# Altium schematic sheet 12.RK3588 DDR Controler.SchDoc
size 420 x 297 mm; Revision: V2.1; Schematic Page Number: 11; Page Number: 12; Check: <Checker>; Schematic Name: RK_NVR_DEMO1_RK3588_LP4/4x_V21; Page Count: 43; Page name: 12.RK3588 DDR Controler; Designer: Zhangdz; Schematic Page Count: 99; Revcode: V2.1; DsnPath: E:\Work\SBER\RK3588_SOM\temp\RK_NVR_DEMO1_RK3588_LP4XD200P232SD8_V21_20211228.DSN; SchematicName: RK_NVR_DEMO1_RK3588_LP4/4x_V21; PageName: 12.RK3588 DDR Controler; PageSize: A3; TopSchematic: True
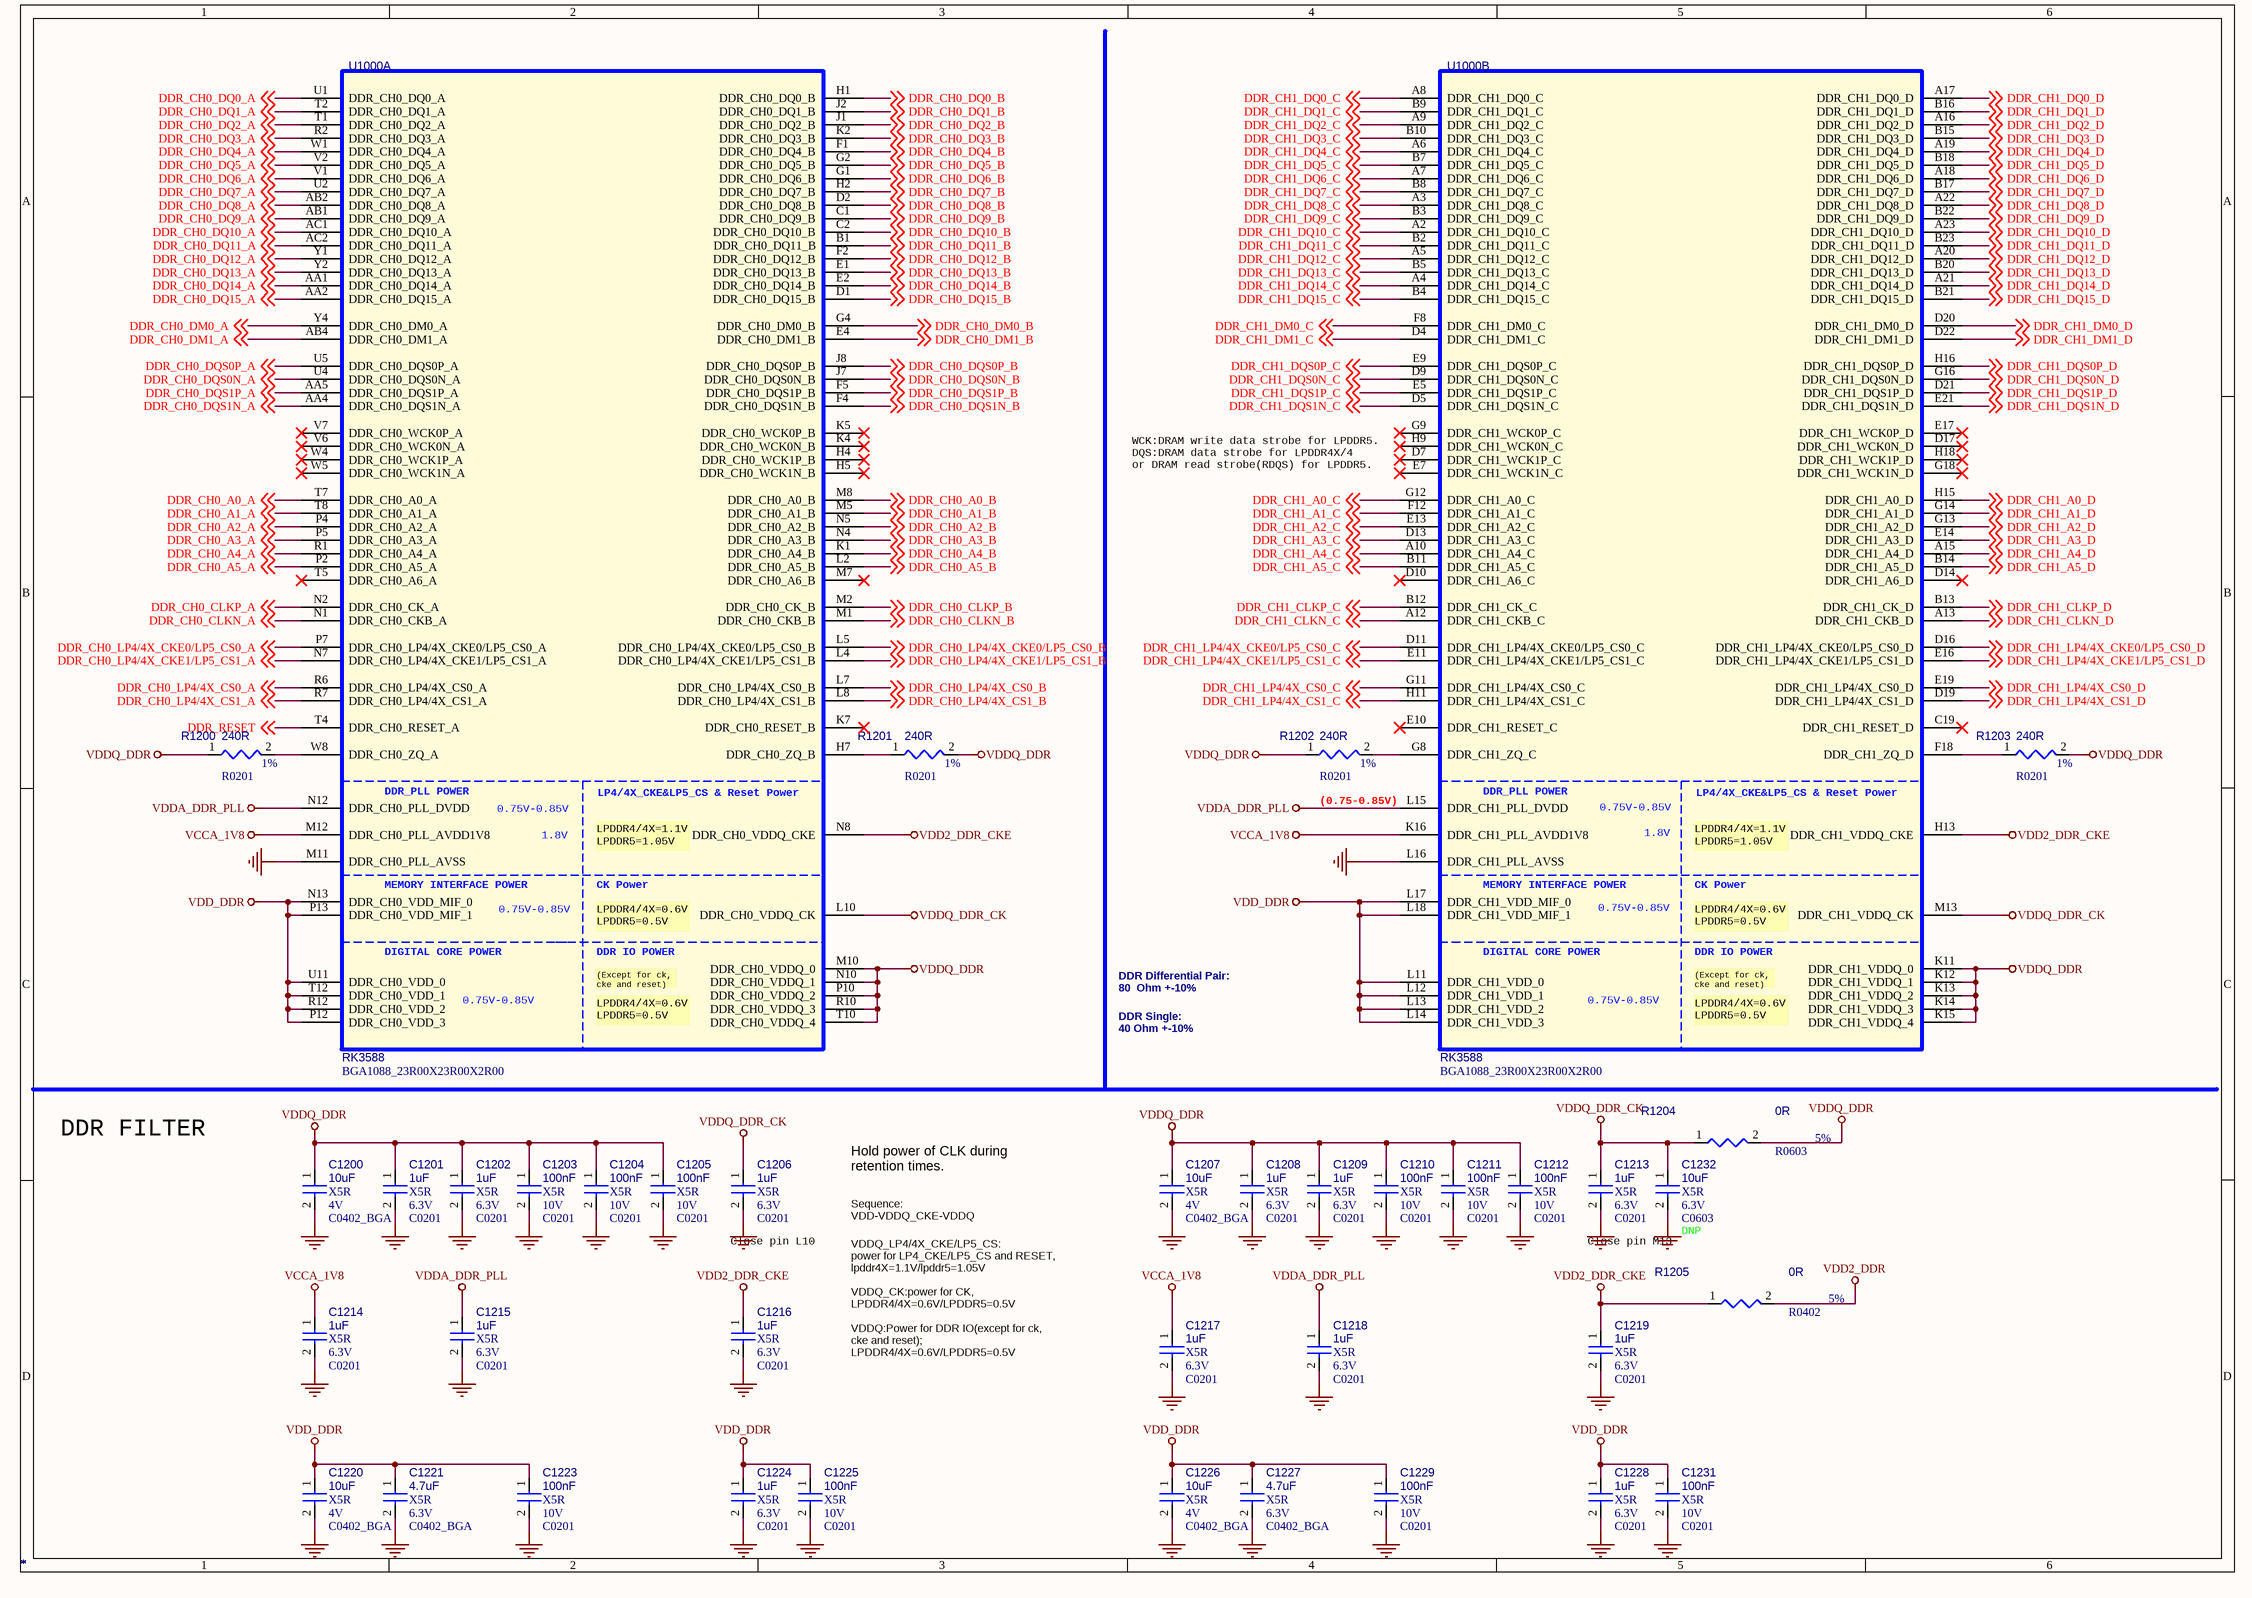
[diagram p0: 12.RK3588 DDR Controler.SchDoc]

## Parts
C1200  *  Voltage: 4V  Dielectric: X5R  [C0402_BGA]
C1201  *  Voltage: 6.3V  Dielectric: X5R  [C0201]
C1202  *  Voltage: 6.3V  Dielectric: X5R  [C0201]
C1203  *  Voltage: 10V  Dielectric: X5R  [C0201]
C1204  *  Voltage: 10V  Dielectric: X5R  [C0201]
C1205  *  Voltage: 10V  Dielectric: X5R  [C0201]
C1206  *  Voltage: 6.3V  Dielectric: X5R  [C0201]
C1207  *  Voltage: 4V  Dielectric: X5R  [C0402_BGA]
C1208  *  Voltage: 6.3V  Dielectric: X5R  [C0201]
C1209  *  Voltage: 6.3V  Dielectric: X5R  [C0201]
C1210  *  Voltage: 10V  Dielectric: X5R  [C0201]
C1211  *  Voltage: 10V  Dielectric: X5R  [C0201]
C1212  *  Voltage: 10V  Dielectric: X5R  [C0201]
C1213  *  Voltage: 6.3V  Dielectric: X5R  [C0201]
C1214  *  Voltage: 6.3V  Dielectric: X5R  [C0201]
C1215  *  Voltage: 6.3V  Dielectric: X5R  [C0201]
C1216  *  Voltage: 6.3V  Dielectric: X5R  [C0201]
C1217  *  Voltage: 6.3V  Dielectric: X5R  [C0201]
C1218  *  Voltage: 6.3V  Dielectric: X5R  [C0201]
C1219  *  Voltage: 6.3V  Dielectric: X5R  [C0201]
C1220  *  Voltage: 4V  Dielectric: X5R  [C0402_BGA]
C1221  *  Voltage: 6.3V  Dielectric: X5R  [C0402_BGA]
C1223  *  Voltage: 10V  Dielectric: X5R  [C0201]
C1224  *  Voltage: 6.3V  Dielectric: X5R  [C0201]
C1225  *  Voltage: 10V  Dielectric: X5R  [C0201]
C1226  *  Voltage: 4V  Dielectric: X5R  [C0402_BGA]
C1227  *  Voltage: 6.3V  Dielectric: X5R  [C0402_BGA]
C1228  *  Voltage: 6.3V  Dielectric: X5R  [C0201]
C1229  *  Voltage: 10V  Dielectric: X5R  [C0201]
C1231  *  Voltage: 10V  Dielectric: X5R  [C0201]
C1232  *  Voltage: 6.3V  Dielectric: X5R  Option: DNP  [C0603]
R1200  *  PCB Footprint: R0201  Tolerance: 1%  [R0402]
R1201  *  PCB Footprint: R0201  Tolerance: 1%  [R0402]
R1202  *  PCB Footprint: R0201  Tolerance: 1%  [R0402]
R1203  *  PCB Footprint: R0201  Tolerance: 1%  [R0402]
R1204  *  PCB Footprint: R0603  Tolerance: 5%  [R0402]
R1205  *  Tolerance: 5%  [R0402]
U1000  *  [BGA1088_23R00X23R00X2R00]  (parts A,B of 26)

## Nets
(0.75-0.85V): C1215.1 C1218.1 U1000.L15(DDR_CH1_PLL_DVDD) U1000.N12(DDR_CH0_PLL_DVDD)  [also labelled VDDA_DDR_PLL]
GND: C1200.2 C1201.2 C1202.2 C1203.2 C1204.2 C1205.2 C1206.2 C1207.2 C1208.2 C1209.2 C1210.2 C1211.2 C1212.2 C1213.2 C1214.2 C1215.2 C1216.2 C1217.2 C1218.2 C1219.2 C1220.2 C1221.2 C1223.2 C1224.2 C1225.2 C1226.2 C1227.2 C1228.2 C1229.2 C1231.2 C1232.2 U1000.L16(DDR_CH1_PLL_AVSS) U1000.M11(DDR_CH0_PLL_AVSS)
VCCA_1V8: C1214.1 C1217.1 U1000.K16(DDR_CH1_PLL_AVDD1V8) U1000.M12(DDR_CH0_PLL_AVDD1V8)
VDD2_DDR: R1205.2
VDD2_DDR_CKE: C1216.1 C1219.1 R1205.1 U1000.H13(DDR_CH1_VDDQ_CKE) U1000.N8(DDR_CH0_VDDQ_CKE)
VDD_DDR: C1220.1 C1221.1 C1223.1 C1224.1 C1225.1 C1226.1 C1227.1 C1228.1 C1229.1 C1231.1 U1000.L11(DDR_CH1_VDD_0) U1000.L12(DDR_CH1_VDD_1) U1000.L13(DDR_CH1_VDD_2) U1000.L14(DDR_CH1_VDD_3) U1000.L17(DDR_CH1_VDD_MIF_0) U1000.L18(DDR_CH1_VDD_MIF_1) U1000.N13(DDR_CH0_VDD_MIF_0) U1000.P12(DDR_CH0_VDD_3) U1000.P13(DDR_CH0_VDD_MIF_1) U1000.R12(DDR_CH0_VDD_2) U1000.T12(DDR_CH0_VDD_1) U1000.U11(DDR_CH0_VDD_0)
VDDQ_DDR: C1200.1 C1201.1 C1202.1 C1203.1 C1204.1 C1205.1 C1207.1 C1208.1 C1209.1 C1210.1 C1211.1 C1212.1 R1200.1 R1201.2 R1202.1 R1203.2 R1204.2 U1000.K11(DDR_CH1_VDDQ_0) U1000.K12(DDR_CH1_VDDQ_1) U1000.K13(DDR_CH1_VDDQ_2) U1000.K14(DDR_CH1_VDDQ_3) U1000.K15(DDR_CH1_VDDQ_4) U1000.M10(DDR_CH0_VDDQ_0) U1000.N10(DDR_CH0_VDDQ_1) U1000.P10(DDR_CH0_VDDQ_2) U1000.R10(DDR_CH0_VDDQ_3) U1000.T10(DDR_CH0_VDDQ_4)
VDDQ_DDR_CK: C1206.1 C1213.1 C1232.1 R1204.1 U1000.L10(DDR_CH0_VDDQ_CK) U1000.M13(DDR_CH1_VDDQ_CK)
DDR_CH0_A0_A: U1000.T7(DDR_CH0_A0_A) ; off-sheet DDR_CH0_A0_A
DDR_CH0_A0_B: U1000.M8(DDR_CH0_A0_B) ; off-sheet DDR_CH0_A0_B
DDR_CH0_A1_A: U1000.T8(DDR_CH0_A1_A) ; off-sheet DDR_CH0_A1_A
DDR_CH0_A1_B: U1000.M5(DDR_CH0_A1_B) ; off-sheet DDR_CH0_A1_B
DDR_CH0_A2_A: U1000.P4(DDR_CH0_A2_A) ; off-sheet DDR_CH0_A2_A
DDR_CH0_A2_B: U1000.N5(DDR_CH0_A2_B) ; off-sheet DDR_CH0_A2_B
DDR_CH0_A3_A: U1000.P5(DDR_CH0_A3_A) ; off-sheet DDR_CH0_A3_A
DDR_CH0_A3_B: U1000.N4(DDR_CH0_A3_B) ; off-sheet DDR_CH0_A3_B
DDR_CH0_A4_A: U1000.R1(DDR_CH0_A4_A) ; off-sheet DDR_CH0_A4_A
DDR_CH0_A4_B: U1000.K1(DDR_CH0_A4_B) ; off-sheet DDR_CH0_A4_B
DDR_CH0_A5_A: U1000.P2(DDR_CH0_A5_A) ; off-sheet DDR_CH0_A5_A
DDR_CH0_A5_B: U1000.L2(DDR_CH0_A5_B) ; off-sheet DDR_CH0_A5_B
DDR_CH0_CLKN_A: U1000.N1(DDR_CH0_CKB_A) ; off-sheet DDR_CH0_CLKN_A
DDR_CH0_CLKN_B: U1000.M1(DDR_CH0_CKB_B) ; off-sheet DDR_CH0_CLKN_B
DDR_CH0_CLKP_A: U1000.N2(DDR_CH0_CK_A) ; off-sheet DDR_CH0_CLKP_A
DDR_CH0_CLKP_B: U1000.M2(DDR_CH0_CK_B) ; off-sheet DDR_CH0_CLKP_B
DDR_CH0_DM0_A: U1000.Y4(DDR_CH0_DM0_A) ; off-sheet DDR_CH0_DM0_A
DDR_CH0_DM0_B: U1000.G4(DDR_CH0_DM0_B) ; off-sheet DDR_CH0_DM0_B
DDR_CH0_DM1_A: U1000.AB4(DDR_CH0_DM1_A) ; off-sheet DDR_CH0_DM1_A
DDR_CH0_DM1_B: U1000.E4(DDR_CH0_DM1_B) ; off-sheet DDR_CH0_DM1_B
DDR_CH0_DQ0_A: U1000.U1(DDR_CH0_DQ0_A) ; off-sheet DDR_CH0_DQ0_A
DDR_CH0_DQ0_B: U1000.H1(DDR_CH0_DQ0_B) ; off-sheet DDR_CH0_DQ0_B
DDR_CH0_DQ1_A: U1000.T2(DDR_CH0_DQ1_A) ; off-sheet DDR_CH0_DQ1_A
DDR_CH0_DQ1_B: U1000.J2(DDR_CH0_DQ1_B) ; off-sheet DDR_CH0_DQ1_B
DDR_CH0_DQ2_A: U1000.T1(DDR_CH0_DQ2_A) ; off-sheet DDR_CH0_DQ2_A
DDR_CH0_DQ2_B: U1000.J1(DDR_CH0_DQ2_B) ; off-sheet DDR_CH0_DQ2_B
DDR_CH0_DQ3_A: U1000.R2(DDR_CH0_DQ3_A) ; off-sheet DDR_CH0_DQ3_A
DDR_CH0_DQ3_B: U1000.K2(DDR_CH0_DQ3_B) ; off-sheet DDR_CH0_DQ3_B
DDR_CH0_DQ4_A: U1000.W1(DDR_CH0_DQ4_A) ; off-sheet DDR_CH0_DQ4_A
DDR_CH0_DQ4_B: U1000.F1(DDR_CH0_DQ4_B) ; off-sheet DDR_CH0_DQ4_B
DDR_CH0_DQ5_A: U1000.V2(DDR_CH0_DQ5_A) ; off-sheet DDR_CH0_DQ5_A
DDR_CH0_DQ5_B: U1000.G2(DDR_CH0_DQ5_B) ; off-sheet DDR_CH0_DQ5_B
DDR_CH0_DQ6_A: U1000.V1(DDR_CH0_DQ6_A) ; off-sheet DDR_CH0_DQ6_A
DDR_CH0_DQ6_B: U1000.G1(DDR_CH0_DQ6_B) ; off-sheet DDR_CH0_DQ6_B
DDR_CH0_DQ7_A: U1000.U2(DDR_CH0_DQ7_A) ; off-sheet DDR_CH0_DQ7_A
DDR_CH0_DQ7_B: U1000.H2(DDR_CH0_DQ7_B) ; off-sheet DDR_CH0_DQ7_B
DDR_CH0_DQ8_A: U1000.AB2(DDR_CH0_DQ8_A) ; off-sheet DDR_CH0_DQ8_A
DDR_CH0_DQ8_B: U1000.D2(DDR_CH0_DQ8_B) ; off-sheet DDR_CH0_DQ8_B
DDR_CH0_DQ9_A: U1000.AB1(DDR_CH0_DQ9_A) ; off-sheet DDR_CH0_DQ9_A
DDR_CH0_DQ9_B: U1000.C1(DDR_CH0_DQ9_B) ; off-sheet DDR_CH0_DQ9_B
DDR_CH0_DQ10_A: U1000.AC1(DDR_CH0_DQ10_A) ; off-sheet DDR_CH0_DQ10_A
DDR_CH0_DQ10_B: U1000.C2(DDR_CH0_DQ10_B) ; off-sheet DDR_CH0_DQ10_B
DDR_CH0_DQ11_A: U1000.AC2(DDR_CH0_DQ11_A) ; off-sheet DDR_CH0_DQ11_A
DDR_CH0_DQ11_B: U1000.B1(DDR_CH0_DQ11_B) ; off-sheet DDR_CH0_DQ11_B
DDR_CH0_DQ12_A: U1000.Y1(DDR_CH0_DQ12_A) ; off-sheet DDR_CH0_DQ12_A
DDR_CH0_DQ12_B: U1000.F2(DDR_CH0_DQ12_B) ; off-sheet DDR_CH0_DQ12_B
DDR_CH0_DQ13_A: U1000.Y2(DDR_CH0_DQ13_A) ; off-sheet DDR_CH0_DQ13_A
DDR_CH0_DQ13_B: U1000.E1(DDR_CH0_DQ13_B) ; off-sheet DDR_CH0_DQ13_B
DDR_CH0_DQ14_A: U1000.AA1(DDR_CH0_DQ14_A) ; off-sheet DDR_CH0_DQ14_A
DDR_CH0_DQ14_B: U1000.E2(DDR_CH0_DQ14_B) ; off-sheet DDR_CH0_DQ14_B
DDR_CH0_DQ15_A: U1000.AA2(DDR_CH0_DQ15_A) ; off-sheet DDR_CH0_DQ15_A
DDR_CH0_DQ15_B: U1000.D1(DDR_CH0_DQ15_B) ; off-sheet DDR_CH0_DQ15_B
DDR_CH0_DQS0N_A: U1000.U4(DDR_CH0_DQS0N_A) ; off-sheet DDR_CH0_DQS0N_A
DDR_CH0_DQS0N_B: U1000.J7(DDR_CH0_DQS0N_B) ; off-sheet DDR_CH0_DQS0N_B
DDR_CH0_DQS0P_A: U1000.U5(DDR_CH0_DQS0P_A) ; off-sheet DDR_CH0_DQS0P_A
DDR_CH0_DQS0P_B: U1000.J8(DDR_CH0_DQS0P_B) ; off-sheet DDR_CH0_DQS0P_B
DDR_CH0_DQS1N_A: U1000.AA4(DDR_CH0_DQS1N_A) ; off-sheet DDR_CH0_DQS1N_A
DDR_CH0_DQS1N_B: U1000.F4(DDR_CH0_DQS1N_B) ; off-sheet DDR_CH0_DQS1N_B
DDR_CH0_DQS1P_A: U1000.AA5(DDR_CH0_DQS1P_A) ; off-sheet DDR_CH0_DQS1P_A
DDR_CH0_DQS1P_B: U1000.F5(DDR_CH0_DQS1P_B) ; off-sheet DDR_CH0_DQS1P_B
DDR_CH0_LP4/4X_CKE0/LP5_CS0_A: U1000.P7(DDR_CH0_LP4/4X_CKE0/LP5_CS0_A) ; off-sheet DDR_CH0_LP4/4X_CKE0/LP5_CS0_A
DDR_CH0_LP4/4X_CKE0/LP5_CS0_B: U1000.L5(DDR_CH0_LP4/4X_CKE0/LP5_CS0_B) ; off-sheet DDR_CH0_LP4/4X_CKE0/LP5_CS0_B
DDR_CH0_LP4/4X_CKE1/LP5_CS1_A: U1000.N7(DDR_CH0_LP4/4X_CKE1/LP5_CS1_A) ; off-sheet DDR_CH0_LP4/4X_CKE1/LP5_CS1_A
DDR_CH0_LP4/4X_CKE1/LP5_CS1_B: U1000.L4(DDR_CH0_LP4/4X_CKE1/LP5_CS1_B) ; off-sheet DDR_CH0_LP4/4X_CKE1/LP5_CS1_B
DDR_CH0_LP4/4X_CS0_A: U1000.R6(DDR_CH0_LP4/4X_CS0_A) ; off-sheet DDR_CH0_LP4/4X_CS0_A
DDR_CH0_LP4/4X_CS0_B: U1000.L7(DDR_CH0_LP4/4X_CS0_B) ; off-sheet DDR_CH0_LP4/4X_CS0_B
DDR_CH0_LP4/4X_CS1_A: U1000.R7(DDR_CH0_LP4/4X_CS1_A) ; off-sheet DDR_CH0_LP4/4X_CS1_A
DDR_CH0_LP4/4X_CS1_B: U1000.L8(DDR_CH0_LP4/4X_CS1_B) ; off-sheet DDR_CH0_LP4/4X_CS1_B
DDR_CH1_A0_C: U1000.G12(DDR_CH1_A0_C) ; off-sheet DDR_CH1_A0_C
DDR_CH1_A0_D: U1000.H15(DDR_CH1_A0_D) ; off-sheet DDR_CH1_A0_D
DDR_CH1_A1_C: U1000.F12(DDR_CH1_A1_C) ; off-sheet DDR_CH1_A1_C
DDR_CH1_A1_D: U1000.G14(DDR_CH1_A1_D) ; off-sheet DDR_CH1_A1_D
DDR_CH1_A2_C: U1000.E13(DDR_CH1_A2_C) ; off-sheet DDR_CH1_A2_C
DDR_CH1_A2_D: U1000.G13(DDR_CH1_A2_D) ; off-sheet DDR_CH1_A2_D
DDR_CH1_A3_C: U1000.D13(DDR_CH1_A3_C) ; off-sheet DDR_CH1_A3_C
DDR_CH1_A3_D: U1000.E14(DDR_CH1_A3_D) ; off-sheet DDR_CH1_A3_D
DDR_CH1_A4_C: U1000.A10(DDR_CH1_A4_C) ; off-sheet DDR_CH1_A4_C
DDR_CH1_A4_D: U1000.A15(DDR_CH1_A4_D) ; off-sheet DDR_CH1_A4_D
DDR_CH1_A5_C: U1000.B11(DDR_CH1_A5_C) ; off-sheet DDR_CH1_A5_C
DDR_CH1_A5_D: U1000.B14(DDR_CH1_A5_D) ; off-sheet DDR_CH1_A5_D
DDR_CH1_CLKN_C: U1000.A12(DDR_CH1_CKB_C) ; off-sheet DDR_CH1_CLKN_C
DDR_CH1_CLKN_D: U1000.A13(DDR_CH1_CKB_D) ; off-sheet DDR_CH1_CLKN_D
DDR_CH1_CLKP_C: U1000.B12(DDR_CH1_CK_C) ; off-sheet DDR_CH1_CLKP_C
DDR_CH1_CLKP_D: U1000.B13(DDR_CH1_CK_D) ; off-sheet DDR_CH1_CLKP_D
DDR_CH1_DM0_C: U1000.F8(DDR_CH1_DM0_C) ; off-sheet DDR_CH1_DM0_C
DDR_CH1_DM0_D: U1000.D20(DDR_CH1_DM0_D) ; off-sheet DDR_CH1_DM0_D
DDR_CH1_DM1_C: U1000.D4(DDR_CH1_DM1_C) ; off-sheet DDR_CH1_DM1_C
DDR_CH1_DM1_D: U1000.D22(DDR_CH1_DM1_D) ; off-sheet DDR_CH1_DM1_D
DDR_CH1_DQ0_C: U1000.A8(DDR_CH1_DQ0_C) ; off-sheet DDR_CH1_DQ0_C
DDR_CH1_DQ0_D: U1000.A17(DDR_CH1_DQ0_D) ; off-sheet DDR_CH1_DQ0_D
DDR_CH1_DQ1_C: U1000.B9(DDR_CH1_DQ1_C) ; off-sheet DDR_CH1_DQ1_C
DDR_CH1_DQ1_D: U1000.B16(DDR_CH1_DQ1_D) ; off-sheet DDR_CH1_DQ1_D
DDR_CH1_DQ2_C: U1000.A9(DDR_CH1_DQ2_C) ; off-sheet DDR_CH1_DQ2_C
DDR_CH1_DQ2_D: U1000.A16(DDR_CH1_DQ2_D) ; off-sheet DDR_CH1_DQ2_D
DDR_CH1_DQ3_C: U1000.B10(DDR_CH1_DQ3_C) ; off-sheet DDR_CH1_DQ3_C
DDR_CH1_DQ3_D: U1000.B15(DDR_CH1_DQ3_D) ; off-sheet DDR_CH1_DQ3_D
DDR_CH1_DQ4_C: U1000.A6(DDR_CH1_DQ4_C) ; off-sheet DDR_CH1_DQ4_C
DDR_CH1_DQ4_D: U1000.A19(DDR_CH1_DQ4_D) ; off-sheet DDR_CH1_DQ4_D
DDR_CH1_DQ5_C: U1000.B7(DDR_CH1_DQ5_C) ; off-sheet DDR_CH1_DQ5_C
DDR_CH1_DQ5_D: U1000.B18(DDR_CH1_DQ5_D) ; off-sheet DDR_CH1_DQ5_D
DDR_CH1_DQ6_C: U1000.A7(DDR_CH1_DQ6_C) ; off-sheet DDR_CH1_DQ6_C
DDR_CH1_DQ6_D: U1000.A18(DDR_CH1_DQ6_D) ; off-sheet DDR_CH1_DQ6_D
DDR_CH1_DQ7_C: U1000.B8(DDR_CH1_DQ7_C) ; off-sheet DDR_CH1_DQ7_C
DDR_CH1_DQ7_D: U1000.B17(DDR_CH1_DQ7_D) ; off-sheet DDR_CH1_DQ7_D
DDR_CH1_DQ8_C: U1000.A3(DDR_CH1_DQ8_C) ; off-sheet DDR_CH1_DQ8_C
DDR_CH1_DQ8_D: U1000.A22(DDR_CH1_DQ8_D) ; off-sheet DDR_CH1_DQ8_D
DDR_CH1_DQ9_C: U1000.B3(DDR_CH1_DQ9_C) ; off-sheet DDR_CH1_DQ9_C
DDR_CH1_DQ9_D: U1000.B22(DDR_CH1_DQ9_D) ; off-sheet DDR_CH1_DQ9_D
DDR_CH1_DQ10_C: U1000.A2(DDR_CH1_DQ10_C) ; off-sheet DDR_CH1_DQ10_C
DDR_CH1_DQ10_D: U1000.A23(DDR_CH1_DQ10_D) ; off-sheet DDR_CH1_DQ10_D
DDR_CH1_DQ11_C: U1000.B2(DDR_CH1_DQ11_C) ; off-sheet DDR_CH1_DQ11_C
DDR_CH1_DQ11_D: U1000.B23(DDR_CH1_DQ11_D) ; off-sheet DDR_CH1_DQ11_D
DDR_CH1_DQ12_C: U1000.A5(DDR_CH1_DQ12_C) ; off-sheet DDR_CH1_DQ12_C
DDR_CH1_DQ12_D: U1000.A20(DDR_CH1_DQ12_D) ; off-sheet DDR_CH1_DQ12_D
DDR_CH1_DQ13_C: U1000.B5(DDR_CH1_DQ13_C) ; off-sheet DDR_CH1_DQ13_C
DDR_CH1_DQ13_D: U1000.B20(DDR_CH1_DQ13_D) ; off-sheet DDR_CH1_DQ13_D
DDR_CH1_DQ14_C: U1000.A4(DDR_CH1_DQ14_C) ; off-sheet DDR_CH1_DQ14_C
DDR_CH1_DQ14_D: U1000.A21(DDR_CH1_DQ14_D) ; off-sheet DDR_CH1_DQ14_D
DDR_CH1_DQ15_C: U1000.B4(DDR_CH1_DQ15_C) ; off-sheet DDR_CH1_DQ15_C
DDR_CH1_DQ15_D: U1000.B21(DDR_CH1_DQ15_D) ; off-sheet DDR_CH1_DQ15_D
DDR_CH1_DQS0N_C: U1000.D9(DDR_CH1_DQS0N_C) ; off-sheet DDR_CH1_DQS0N_C
DDR_CH1_DQS0N_D: U1000.G16(DDR_CH1_DQS0N_D) ; off-sheet DDR_CH1_DQS0N_D
DDR_CH1_DQS0P_C: U1000.E9(DDR_CH1_DQS0P_C) ; off-sheet DDR_CH1_DQS0P_C
DDR_CH1_DQS0P_D: U1000.H16(DDR_CH1_DQS0P_D) ; off-sheet DDR_CH1_DQS0P_D
DDR_CH1_DQS1N_C: U1000.D5(DDR_CH1_DQS1N_C) ; off-sheet DDR_CH1_DQS1N_C
DDR_CH1_DQS1N_D: U1000.E21(DDR_CH1_DQS1N_D) ; off-sheet DDR_CH1_DQS1N_D
DDR_CH1_DQS1P_C: U1000.E5(DDR_CH1_DQS1P_C) ; off-sheet DDR_CH1_DQS1P_C
DDR_CH1_DQS1P_D: U1000.D21(DDR_CH1_DQS1P_D) ; off-sheet DDR_CH1_DQS1P_D
DDR_CH1_LP4/4X_CKE0/LP5_CS0_C: U1000.D11(DDR_CH1_LP4/4X_CKE0/LP5_CS0_C) ; off-sheet DDR_CH1_LP4/4X_CKE0/LP5_CS0_C
DDR_CH1_LP4/4X_CKE0/LP5_CS0_D: U1000.D16(DDR_CH1_LP4/4X_CKE0/LP5_CS0_D) ; off-sheet DDR_CH1_LP4/4X_CKE0/LP5_CS0_D
DDR_CH1_LP4/4X_CKE1/LP5_CS1_C: U1000.E11(DDR_CH1_LP4/4X_CKE1/LP5_CS1_C) ; off-sheet DDR_CH1_LP4/4X_CKE1/LP5_CS1_C
DDR_CH1_LP4/4X_CKE1/LP5_CS1_D: U1000.E16(DDR_CH1_LP4/4X_CKE1/LP5_CS1_D) ; off-sheet DDR_CH1_LP4/4X_CKE1/LP5_CS1_D
DDR_CH1_LP4/4X_CS0_C: U1000.G11(DDR_CH1_LP4/4X_CS0_C) ; off-sheet DDR_CH1_LP4/4X_CS0_C
DDR_CH1_LP4/4X_CS0_D: U1000.E19(DDR_CH1_LP4/4X_CS0_D) ; off-sheet DDR_CH1_LP4/4X_CS0_D
DDR_CH1_LP4/4X_CS1_C: U1000.H11(DDR_CH1_LP4/4X_CS1_C) ; off-sheet DDR_CH1_LP4/4X_CS1_C
DDR_CH1_LP4/4X_CS1_D: U1000.D19(DDR_CH1_LP4/4X_CS1_D) ; off-sheet DDR_CH1_LP4/4X_CS1_D
DDR_RESET: U1000.T4(DDR_CH0_RESET_A) ; off-sheet DDR_RESET
NetR1200_2: R1200.2 U1000.W8(DDR_CH0_ZQ_A)
NetR1201_1: R1201.1 U1000.H7(DDR_CH0_ZQ_B)
NetR1202_2: R1202.2 U1000.G8(DDR_CH1_ZQ_C)
NetR1203_1: R1203.1 U1000.F18(DDR_CH1_ZQ_D)

Not connected (* = marked no-connect by the designer): U1000 C19(DDR_CH1_RESET_D)* D7(DDR_CH1_WCK1P_C)* D10(DDR_CH1_A6_C)* D14(DDR_CH1_A6_D)* D17(DDR_CH1_WCK0N_D)* E7(DDR_CH1_WCK1N_C)* E10(DDR_CH1_RESET_C)* E17(DDR_CH1_WCK0P_D)* G9(DDR_CH1_WCK0P_C)* G18(DDR_CH1_WCK1N_D)* H4(DDR_CH0_WCK1P_B)* H5(DDR_CH0_WCK1N_B)* H9(DDR_CH1_WCK0N_C)* H18(DDR_CH1_WCK1P_D)* K4(DDR_CH0_WCK0N_B)* K5(DDR_CH0_WCK0P_B)* K7(DDR_CH0_RESET_B)* M7(DDR_CH0_A6_B)* T5(DDR_CH0_A6_A)* V6(DDR_CH0_WCK0N_A)* V7(DDR_CH0_WCK0P_A)* W4(DDR_CH0_WCK1P_A)* W5(DDR_CH0_WCK1N_A)*

## Notes on the sheet
- (near U1000) WCK:DRAM write data strobe for LPDDR5.
  DQS:DRAM data strobe for LPDDR4X/4
  or DRAM read strobe(RDQS) for LPDDR5.
- DDR Differential Pair:
  80  Ohm +-10%
- DDR Single:
  40 Ohm +-10%
- DDR FILTER
- Hold power of CLK during
  retention times.
- (near C1206) Close pin L10
- Sequence:
  VDD-VDDQ_CKE-VDDQ
- Close pin M13
- VDDQ_LP4/4X_CKE/LP5_CS:
  power for LP4_CKE/LP5_CS and RESET,
  lpddr4X=1.1V/lpddr5=1.05V
  VDDQ_CK:power for CK,
  LPDDR4/4X=0.6V/LPDDR5=0.5V
  VDDQ:Power for DDR IO(except for ck,
  cke and reset);
  LPDDR4/4X=0.6V/LPDDR5=0.5V
- (in symbol SOC_RK3588, part A) DDR_PLL POWER; LP4/4X_CKE&LP5_CS & Reset Power; 0.75V-0.85V; 1.8V; LPDDR4/4X=1.1V / LPDDR5=1.05V; MEMORY INTERFACE POWER; CK Power; LPDDR4/4X=0.6V / LPDDR5=0.5V; DIGITAL CORE POWER; DDR IO POWER; (Except for ck, / cke and reset)
- (in symbol SOC_RK3588, part B) DDR_PLL POWER; LP4/4X_CKE&LP5_CS & Reset Power; 0.75V-0.85V; 1.8V; LPDDR4/4X=1.1V / LPDDR5=1.05V; MEMORY INTERFACE POWER; CK Power; LPDDR4/4X=0.6V / LPDDR5=0.5V; DIGITAL CORE POWER; DDR IO POWER; (Except for ck, / cke and reset)

## Library data of the parts
C1200 = CAP NP: cap,10.00uF,+/-20%,4V,X5R,C0402; Part Reference: C1200; Manufacturer PN: CC0402MRX5R4BB106; Manufacturer: YAGEO; Value: 10uF; Tolerance: 20%; C_Voltage: 6.3V; Priority: A; PCB Footprint: C0402_BGA; Created by: JJJ; Part Type: C0402; RK PN: CC0402MRX5R4BB106
C1201 = CAP NP: cap,1.00uF,+/-20%,6.3V,X5R,C0201; Part Reference: C1201; Manufacturer PN: C0603X5R0J105M030BC; Manufacturer: TDK; Value: 1uF; Tolerance: 20%; Priority: A; PCB Footprint: C0201; Created by: JJJ; Part Type: C0201; RK PN: C0603X5R0J105M030BC
C1202 = CAP NP: cap,1.00uF,+/-20%,6.3V,X5R,C0201; Part Reference: C1202; Manufacturer: TDK; Value: 1uF; RK PN: C0603X5R0J105M030BC; Priority: A; Tolerance: 20%; PCB Footprint: C0201; Part Type: C0201; Manufacturer PN: C0603X5R0J105M030BC; Created by: JJJ
C1203 = CAP NP: cap,100.00nF,+/-10%,10V,X5R,C0201; Part Reference: C1203; Manufacturer: TDK; Value: 100nF; RK PN: C0603X5R1A104K030BC; Priority: A; Tolerance: 10%; PCB Footprint: C0201; Part Type: C0201; Manufacturer PN: C0603X5R1A104K030BC; Created by: JJJ
C1204 = CAP NP: cap,100.00nF,+/-10%,10V,X5R,C0201; Part Reference: C1204; Manufacturer: TDK; Value: 100nF; RK PN: C0603X5R1A104K030BC; Priority: A; Tolerance: 10%; PCB Footprint: C0201; Part Type: C0201; Manufacturer PN: C0603X5R1A104K030BC; Created by: JJJ
C1205 = CAP NP: cap,100.00nF,+/-10%,10V,X5R,C0201; Part Reference: C1205; Manufacturer: TDK; Value: 100nF; RK PN: C0603X5R1A104K030BC; Priority: A; Tolerance: 10%; PCB Footprint: C0201; Part Type: C0201; Manufacturer PN: C0603X5R1A104K030BC; Created by: JJJ
C1206 = CAP NP: cap,1.00uF,+/-20%,6.3V,X5R,C0201; Part Reference: C1206; Manufacturer PN: C0603X5R0J105M030BC; Manufacturer: TDK; Value: 1uF; Tolerance: 20%; Priority: A; PCB Footprint: C0201; Created by: JJJ; Part Type: C0201; RK PN: C0603X5R0J105M030BC
C1207 = CAP NP: cap,10.00uF,+/-20%,4V,X5R,C0402; Part Reference: C1207; Manufacturer PN: CC0402MRX5R4BB106; Manufacturer: YAGEO; Value: 10uF; Tolerance: 20%; C_Voltage: 6.3V; Priority: A; PCB Footprint: C0402_BGA; Created by: JJJ; Part Type: C0402; RK PN: CC0402MRX5R4BB106
C1208 = CAP NP: cap,1.00uF,+/-20%,6.3V,X5R,C0201; Part Reference: C1208; Manufacturer PN: C0603X5R0J105M030BC; Manufacturer: TDK; Value: 1uF; Tolerance: 20%; Priority: A; PCB Footprint: C0201; Created by: JJJ; Part Type: C0201; RK PN: C0603X5R0J105M030BC
C1209 = CAP NP: cap,1.00uF,+/-20%,6.3V,X5R,C0201; Part Reference: C1209; Manufacturer: TDK; Value: 1uF; RK PN: C0603X5R0J105M030BC; Priority: A; Tolerance: 20%; PCB Footprint: C0201; Part Type: C0201; Manufacturer PN: C0603X5R0J105M030BC; Created by: JJJ
C1210 = CAP NP: cap,100.00nF,+/-10%,10V,X5R,C0201; Part Reference: C1210; Manufacturer: TDK; Value: 100nF; RK PN: C0603X5R1A104K030BC; Priority: A; Tolerance: 10%; PCB Footprint: C0201; Part Type: C0201; Manufacturer PN: C0603X5R1A104K030BC; Created by: JJJ
C1211 = CAP NP: cap,100.00nF,+/-10%,10V,X5R,C0201; Part Reference: C1211; Manufacturer: TDK; Value: 100nF; RK PN: C0603X5R1A104K030BC; Priority: A; Tolerance: 10%; PCB Footprint: C0201; Part Type: C0201; Manufacturer PN: C0603X5R1A104K030BC; Created by: JJJ
C1212 = CAP NP: cap,100.00nF,+/-10%,10V,X5R,C0201; Part Reference: C1212; Manufacturer: TDK; Value: 100nF; RK PN: C0603X5R1A104K030BC; Priority: A; Tolerance: 10%; PCB Footprint: C0201; Part Type: C0201; Manufacturer PN: C0603X5R1A104K030BC; Created by: JJJ
C1213 = CAP NP: cap,1.00uF,+/-20%,6.3V,X5R,C0201; Part Reference: C1213; Manufacturer PN: C0603X5R0J105M030BC; Manufacturer: TDK; Value: 1uF; Tolerance: 20%; Priority: A; PCB Footprint: C0201; Created by: JJJ; Part Type: C0201; RK PN: C0603X5R0J105M030BC
C1214 = CAP NP: cap,1.00uF,+/-20%,6.3V,X5R,C0201; Part Reference: C1214; Manufacturer: TDK; Value: 1uF; RK PN: C0603X5R0J105M030BC; Priority: A; Tolerance: 20%; PCB Footprint: C0201; Part Type: C0201; Manufacturer PN: C0603X5R0J105M030BC; Created by: JJJ
C1215 = CAP NP: cap,1.00uF,+/-20%,6.3V,X5R,C0201; Part Reference: C1215; Manufacturer PN: C0603X5R0J105M030BC; Manufacturer: TDK; Value: 1uF; Tolerance: 20%; Priority: A; PCB Footprint: C0201; Created by: JJJ; Part Type: C0201; RK PN: C0603X5R0J105M030BC
C1216 = CAP NP: cap,1.00uF,+/-20%,6.3V,X5R,C0201; Part Reference: C1216; Manufacturer PN: C0603X5R0J105M030BC; Manufacturer: TDK; Value: 1uF; Tolerance: 20%; Priority: A; PCB Footprint: C0201; Created by: JJJ; Part Type: C0201; RK PN: C0603X5R0J105M030BC
C1217 = CAP NP: cap,1.00uF,+/-20%,6.3V,X5R,C0201; Part Reference: C1217; Manufacturer PN: C0603X5R0J105M030BC; Manufacturer: TDK; Value: 1uF; Tolerance: 20%; Priority: A; PCB Footprint: C0201; Created by: JJJ; Part Type: C0201; RK PN: C0603X5R0J105M030BC
C1218 = CAP NP: cap,1.00uF,+/-20%,6.3V,X5R,C0201; Part Reference: C1218; Manufacturer: TDK; Value: 1uF; RK PN: C0603X5R0J105M030BC; Priority: A; Tolerance: 20%; PCB Footprint: C0201; Part Type: C0201; Manufacturer PN: C0603X5R0J105M030BC; Created by: JJJ
C1219 = CAP NP: cap,1.00uF,+/-20%,6.3V,X5R,C0201; Part Reference: C1219; Manufacturer: TDK; Value: 1uF; RK PN: C0603X5R0J105M030BC; Priority: A; Tolerance: 20%; PCB Footprint: C0201; Part Type: C0201; Manufacturer PN: C0603X5R0J105M030BC; Created by: JJJ
C1220 = CAP NP: cap,10.00uF,+/-20%,4V,X5R,C0402; Part Reference: C1220; Manufacturer: YAGEO; Value: 10uF; RK PN: CC0402MRX5R4BB106; Priority: A; Tolerance: 20%; PCB Footprint: C0402_BGA; Part Type: C0402; Manufacturer PN: CC0402MRX5R4BB106; Created by: JJJ
C1221 = CAP NP: cap,4.70uF,+/-10%,6.3V,X5R,C0402; Part Reference: C1221; Manufacturer PN: C1005X5R0J475K050BC; Manufacturer: TDK; Value: 4.7uF; Tolerance: 10%; Priority: A; PCB Footprint: C0402_BGA; Created by: JJJ; Part Type: C0402; RK PN: C1005X5R0J475K050BC
C1223 = CAP NP: cap,100.00nF,+/-10%,10V,X5R,C0201; Part Reference: C1223; Manufacturer: TDK; Value: 100nF; RK PN: C0603X5R1A104K030BC; Priority: A; Tolerance: 10%; PCB Footprint: C0201; Part Type: C0201; Manufacturer PN: C0603X5R1A104K030BC; Created by: JJJ
C1224 = CAP NP: cap,1.00uF,+/-20%,6.3V,X5R,C0201; Part Reference: C1224; Manufacturer PN: C0603X5R0J105M030BC; Manufacturer: TDK; Value: 1uF; Tolerance: 20%; Priority: A; PCB Footprint: C0201; Created by: JJJ; Part Type: C0201; RK PN: C0603X5R0J105M030BC
C1225 = CAP NP: cap,100.00nF,+/-10%,10V,X5R,C0201; Part Reference: C1225; Manufacturer: TDK; Value: 100nF; RK PN: C0603X5R1A104K030BC; Priority: A; Tolerance: 10%; PCB Footprint: C0201; Part Type: C0201; Manufacturer PN: C0603X5R1A104K030BC; Created by: JJJ
C1226 = CAP NP: cap,10.00uF,+/-20%,4V,X5R,C0402; Part Reference: C1226; Manufacturer: YAGEO; Value: 10uF; RK PN: CC0402MRX5R4BB106; Priority: A; Tolerance: 20%; PCB Footprint: C0402_BGA; Part Type: C0402; Manufacturer PN: CC0402MRX5R4BB106; Created by: JJJ
C1227 = CAP NP: cap,4.70uF,+/-10%,6.3V,X5R,C0402; Part Reference: C1227; Manufacturer PN: C1005X5R0J475K050BC; Manufacturer: TDK; Value: 4.7uF; Tolerance: 10%; Priority: A; PCB Footprint: C0402_BGA; Created by: JJJ; Part Type: C0402; RK PN: C1005X5R0J475K050BC
C1228 = CAP NP: cap,1.00uF,+/-20%,6.3V,X5R,C0201; Part Reference: C1228; Manufacturer: TDK; Value: 1uF; RK PN: C0603X5R0J105M030BC; Priority: A; Tolerance: 20%; PCB Footprint: C0201; Part Type: C0201; Manufacturer PN: C0603X5R0J105M030BC; Created by: JJJ
C1229 = CAP NP: cap,100.00nF,+/-10%,10V,X5R,C0201; Part Reference: C1229; Manufacturer: TDK; Value: 100nF; RK PN: C0603X5R1A104K030BC; Priority: A; Tolerance: 10%; PCB Footprint: C0201; Part Type: C0201; Manufacturer PN: C0603X5R1A104K030BC; Created by: JJJ
C1231 = CAP NP: cap,100.00nF,+/-10%,10V,X5R,C0201; Part Reference: C1231; Manufacturer: TDK; Value: 100nF; RK PN: C0603X5R1A104K030BC; Priority: A; Tolerance: 10%; PCB Footprint: C0201; Part Type: C0201; Manufacturer PN: C0603X5R1A104K030BC; Created by: JJJ
C1232 = CAP NP: cap,10.00uF,+/-10%,6.3V,X5R,C0603; Part Reference: C1232; Manufacturer: TDK; Value: 10uF; RK PN: C1608X5R0J106K080AB; Priority: A; Tolerance: 10%; PCB Footprint: C0603; Part Type: C0603; Manufacturer PN: C1608X5R0J106K080AB; Created by: JJJ
R1200 = RESISTOR_Dup1: НЁУГєсД¤µзЧи,240R,+/-1%,R0201,1/20W.; Part Reference: R1200; Manufacturer: YAGEO; RK PN: RC0201FR-07240RL; Priority: A; Wattage: 1/20W; Value: 240R; Part Type: НЁУГєсД¤µзЧи; Manufacturer PN: RC0201FR-07240RL; Created by: YTL
R1201 = RESISTOR_Dup1: НЁУГєсД¤µзЧи,240R,+/-1%,R0201,1/20W.; Part Reference: R1201; Manufacturer: YAGEO; RK PN: RC0201FR-07240RL; Priority: A; Wattage: 1/20W; Value: 240R; Part Type: НЁУГєсД¤µзЧи; Manufacturer PN: RC0201FR-07240RL; Created by: YTL
R1202 = RESISTOR_Dup1: НЁУГєсД¤µзЧи,240R,+/-1%,R0201,1/20W.; Part Reference: R1202; Manufacturer PN: RC0201FR-07240RL; Manufacturer: YAGEO; Wattage: 1/20W; Priority: A; Value: 240R; Created by: YTL; Part Type: НЁУГєсД¤µзЧи; RK PN: RC0201FR-07240RL
R1203 = RESISTOR_Dup1: НЁУГєсД¤µзЧи,240R,+/-1%,R0201,1/20W.; Part Reference: R1203; Manufacturer: YAGEO; RK PN: RC0201FR-07240RL; Priority: A; Wattage: 1/20W; Value: 240R; Part Type: НЁУГєсД¤µзЧи; Manufacturer PN: RC0201FR-07240RL; Created by: YTL
R1204 = RESISTOR_Dup1: НЁУГєсД¤µзЧи,0R,+/-5%,R0603,1/10W.; Part Reference: R1204; Manufacturer PN: RC0603JR-070RL; Manufacturer: YAGEO; Wattage: 1/10W; Priority: A; Value: 0R; Created by: YTL; Part Type: НЁУГєсД¤µзЧи; RK PN: RC0603JR-070RL
R1205 = RESISTOR_Dup1: НЁУГєсД¤µзЧи,0R,+/-5%,R0402,1/16W.; Part Reference: R1205; Manufacturer PN: RC0402JR-070RL; Manufacturer: YAGEO; Wattage: 1/16W; Priority: A; PCB Footprint: R0402; Value: 0R; Created by: YTL; Part Type: НЁУГєсД¤µзЧи; RK PN: RC0402JR-070RL
U1000 = SOC_RK3588: ROCKCHIP SOC; Part Reference: U1000; Manufacturer: Rockchip (ИрРѕОў); SPLIT_INST: TRUE; SWAP_INFO: (S1+S2+S3+S4+S5+S6+S7+S8+S9+S10+S11+S12+S13+S14+S15+S16+S17+S18+S19+S20+S21+S22+S23+S24+S25+S26); Value: RK3588; Priority: A; RK PN: RK3588; Part Type: SOC; Manufacturer PN: RK3588; Created by: YWQ; PCB Footprint: BGA1088_23R00X23R00X2R00